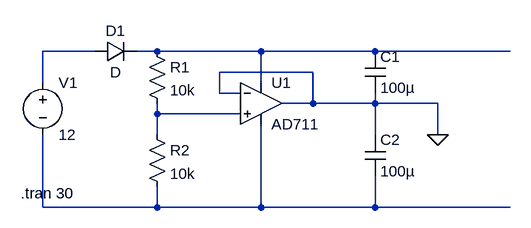
[diagram p0: schematic 5V.asc]
5V.asc, the LTspice schematic file:
Version 4
SHEET 1 880 680
WIRE 16 80 -64 80
WIRE 112 80 80 80
WIRE 272 80 112 80
WIRE 448 80 272 80
WIRE 656 80 448 80
WIRE 352 112 208 112
WIRE -64 128 -64 80
WIRE 272 128 272 80
WIRE 208 144 208 112
WIRE 240 144 208 144
WIRE 352 160 352 112
WIRE 352 160 304 160
WIRE 448 160 448 144
WIRE 448 160 352 160
WIRE 544 160 448 160
WIRE 112 176 112 160
WIRE 240 176 112 176
WIRE 112 208 112 176
WIRE 448 208 448 160
WIRE 544 208 544 160
WIRE -64 320 -64 208
WIRE 112 320 112 288
WIRE 112 320 -64 320
WIRE 272 320 272 192
WIRE 272 320 112 320
WIRE 448 320 448 272
WIRE 448 320 272 320
WIRE 656 320 448 320
FLAG 544 208 0
SYMBOL res 96 64 R0
SYMATTR InstName R1
SYMATTR Value 10k
SYMBOL res 96 192 R0
SYMATTR InstName R2
SYMATTR Value 10k
SYMBOL voltage -64 112 R0
WINDOW 123 0 0 Left 0
WINDOW 39 0 0 Left 0
SYMATTR InstName V1
SYMATTR Value 12
SYMBOL OpAmps\\AD711 272 96 R0
SYMATTR InstName U1
SYMBOL diode 16 96 R270
WINDOW 0 32 32 VTop 2
WINDOW 3 0 32 VBottom 2
SYMATTR InstName D1
SYMBOL cap 432 80 R0
SYMATTR InstName C1
SYMATTR Value 100µ
SYMBOL cap 432 208 R0
SYMATTR InstName C2
SYMATTR Value 100µ
TEXT -98 298 Left 2 !.tran 30

The netlist it stands for:
* 5V.asc
R1 N002 N003 10k
R2 N003 N004 10k
V1 N001 N004 12
XU1 N003 0 N002 N004 0 AD712  ; AD711, pins In+ In- V+ V- OUT
D1 N001 N002 D
C1 N002 0 100µ
C2 0 N004 100µ
.model D D
.lib standard.dio
.tran 30
.lib ADI1.lib
.backanno
.end